# Altium schematic sheet 电源模块.SchDoc
size A4
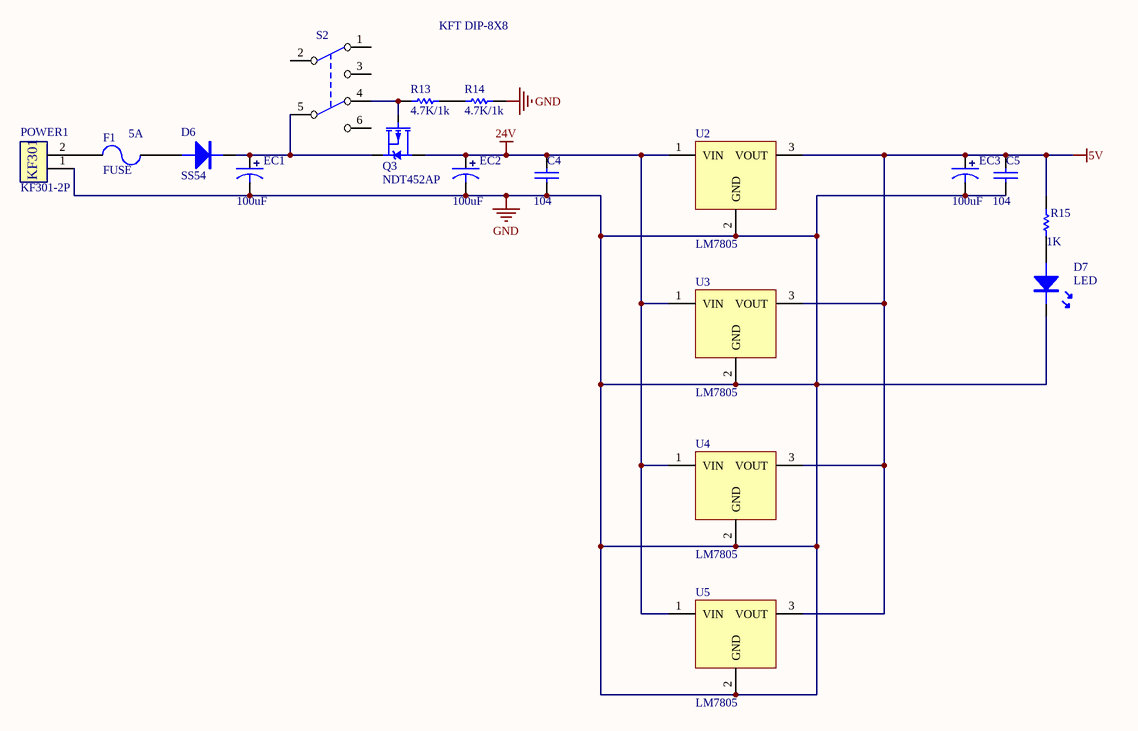
[diagram p0: 电源模块.SchDoc]

## Parts
C4  value 104  [0603C]  (hidden comment: CAP)
C5  value 104  [0603C]  (hidden comment: CAP)
D6  SS54  [SMA/DO-214AC]
D7  LED  [LED3-YEL]
EC1  value 100uF  [DIP-EC6.3X11]  (hidden comment: SMD_ECAP)
EC2  value 100uF  [DIP-EC6.3X11]  (hidden comment: SMD_ECAP)
EC3  value 100uF  [DIP-EC6.3X11]  (hidden comment: SMD_ECAP)
F1  FUSE  value 5A  [FUSE-RAD0.2]
POWER1  KF301-2P  [KF301-5.0-2P]
Q3  NDT452AP  [SOT223]
R13  value 4.7K/1k  [0603R]  (hidden comment: RES)
R14  value 4.7K/1k  [0603R]  (hidden comment: RES)
R15  value 1K  [0603R]  (hidden comment: RES)
S2  KFT DIP-8X8  [KFT DIP-8X8]
U2  LM7805  [TO220A]
U3  LM7805  [TO220A]
U4  LM7805  [TO220A]
U5  LM7805  [TO220A]

## Nets
5V: C5.2 EC3.1 R15.2 U2.3(VOUT) U3.3(VOUT) U4.3(VOUT) U5.3(VOUT)
24V: C4.2 EC2.1 Q3.2(D) U2.1(VIN) U3.1(VIN) U4.1(VIN) U5.1(VIN)
GND: C4.1 C5.1 D7.K EC1.2 EC2.2 EC3.2 POWER1.1 R14.2 U2.2(GND) U3.2(GND) U4.2(GND) U5.2(GND)
NetD6_A: D6.A F1.2
NetD6_K: D6.K EC1.1 Q3.3(S) S2.5
NetD7_A: D7.A R15.1
NetF1_1: F1.1 POWER1.2
NetQ3_1: Q3.1(G) R13.1 S2.4
NetR13_2: R13.2 R14.1

Not connected (* = marked no-connect by the designer): S2 1 2 3 6

## Notes on the sheet
- (in symbol KF301-2P) KF301

## Library data of the parts
C4 C5 = CAP: 无极性电容
D6 = DIODE: 普通二极管
EC1 EC2 = SMD_ECAP: 电解电容
EC3 = SMD_ECAP: 贴片电解电容
Q3 = P-MOS: P沟道场效应管